# Altium schematic sheet Power.SchDoc
size A4; SheetNumber: 3; SheetTotal: 8
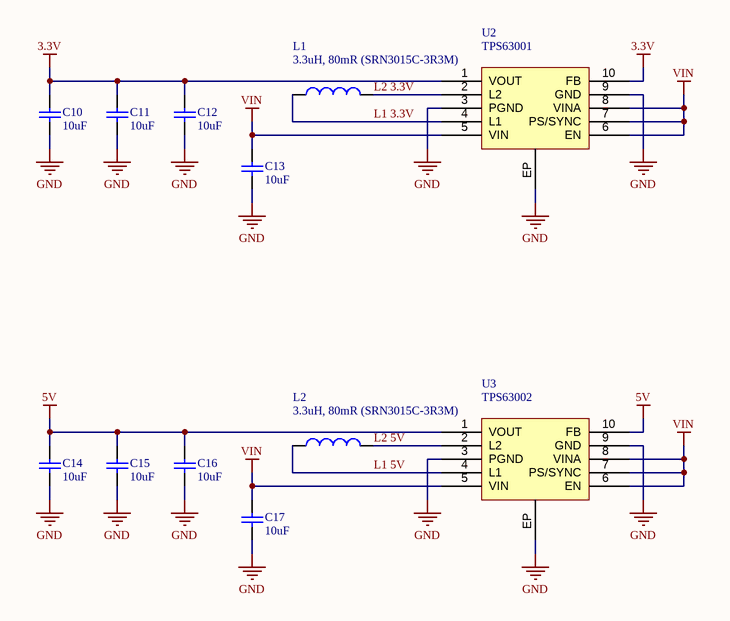
[diagram p0: Power.SchDoc]

## Parts
C10  10uF  [Capacitor 0402]
C11  10uF  [Capacitor 0402]
C12  10uF  [Capacitor 0402]
C13  10uF  [Capacitor 0402]
C14  10uF  [Capacitor 0402]
C15  10uF  [Capacitor 0402]
C16  10uF  [Capacitor 0402]
C17  10uF  [Capacitor 0402]
L1  3.3uH, 80mR (SRN3015C-3R3M)  [SRN3015C]
L2  3.3uH, 80mR (SRN3015C-3R3M)  [SRN3015C]
U2  TPS63001  [VSON-10]
U3  TPS63002  [VSON-10]

## Nets
3.3V: C10.2 C11.2 C12.2 U2.1(VOUT) U2.10(FB)
5V: C14.2 C15.2 C16.2 U3.1(VOUT) U3.10(FB)
GND: C10.1 C11.1 C12.1 C13.1 C14.1 C15.1 C16.1 C17.1 U2.3(PGND) U2.9(GND) U2.EP U3.3(PGND) U3.9(GND) U3.EP
VIN: C13.2 C17.2 U2.5(VIN) U2.6(EN) U2.7(PS/SYNC) U2.8(VINA) U3.5(VIN) U3.6(EN) U3.7(PS/SYNC) U3.8(VINA)
L1 3.3V: L1.1 U2.4(L1)
L1 5V: L2.1 U3.4(L1)
L2 3.3V: L1.2 U2.2(L2)
L2 5V: L2.2 U3.2(L2)

## Notes on the sheet
- TITLE
- SIZE
- A4
- VARIANT
- PROJECT
- SHEET
- VERSION
- OF
- AUTHOR
- DATE

## Library data of the parts
C10-C17 = Capacitor
L1 L2 = Inductor
U2 U3 = TPS630XX